# Altium project ANALOG_CAN_BOARD_2018.PrjPCB
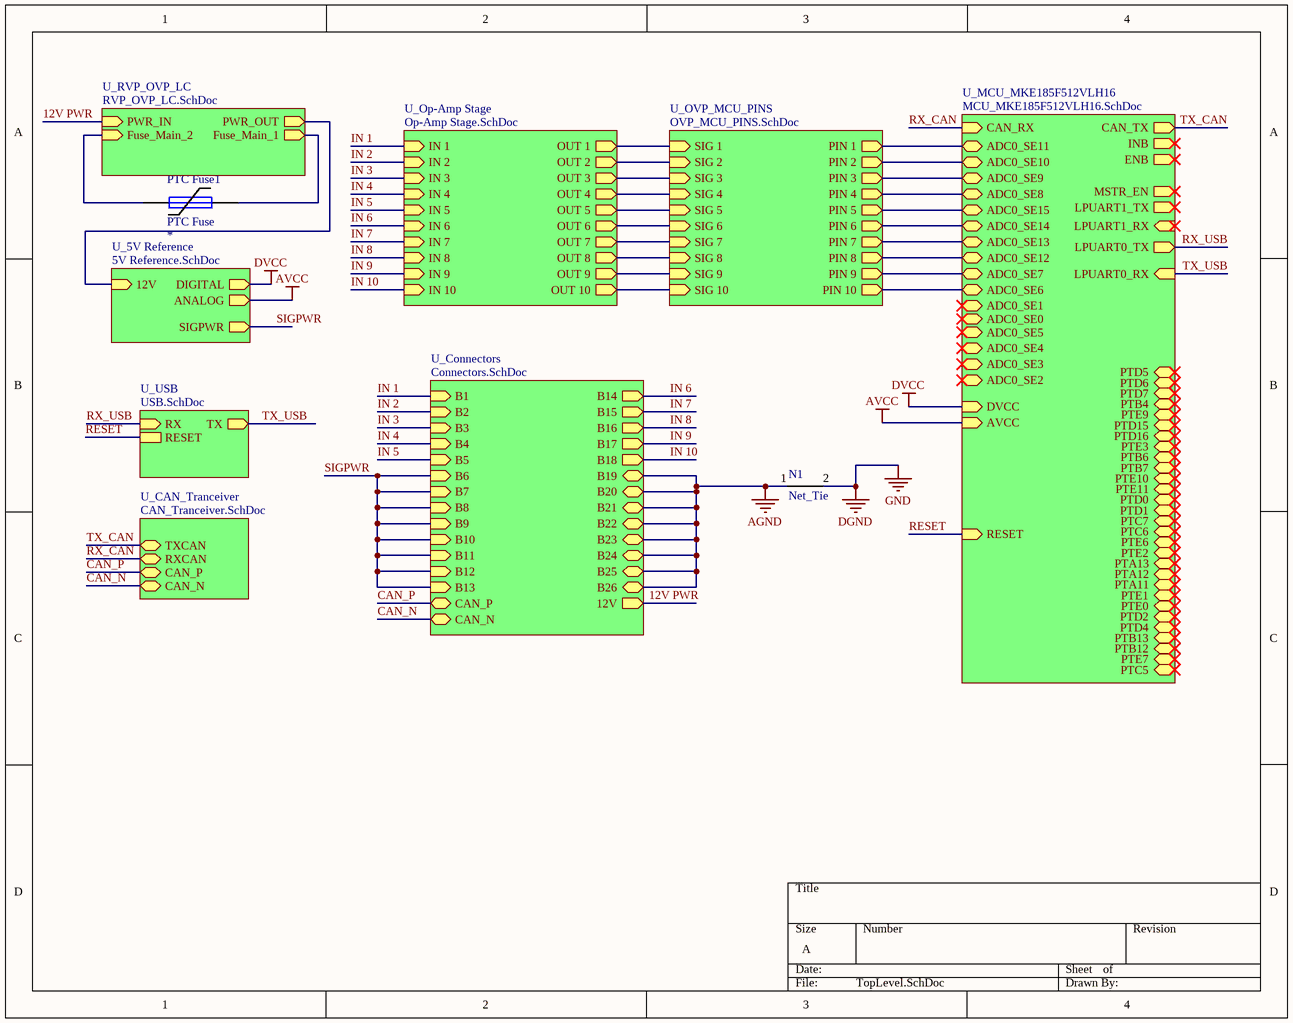
[diagram p0: TopLevel.SchDoc]
8 sheets, 169 parts. Net scope: hierarchical (ports join the sheet entries above them; power ports are global).
Board file: ANALOG_CAN2.PcbDoc
Sheets:
  TopLevel.SchDoc
    U_Connectors = Connectors.SchDoc
    U_5V Reference = 5V Reference.SchDoc
    U_OVP_MCU_PINS = OVP_MCU_PINS.SchDoc
    U_Op-Amp Stage = Op-Amp Stage.SchDoc
      U_Sallen-Key Filter = Sallen-Key Filter.SchDoc
      U_Sallen-Key Filter = Sallen-Key Filter.SchDoc
      U_Sallen-Key Filter = Sallen-Key Filter.SchDoc
      U_Sallen-Key Filter = Sallen-Key Filter.SchDoc
      U_Sallen-Key Filter = Sallen-Key Filter.SchDoc
      U_LBF Op-Amp Gain = LBF Op-Amp Gain.SchDoc
      U_LBF Op-Amp Gain = LBF Op-Amp Gain.SchDoc
      U_LBF Op-Amp Gain = LBF Op-Amp Gain.SchDoc
      U_LBF Op-Amp Gain = LBF Op-Amp Gain.SchDoc
      U_LBF Op-Amp Gain = LBF Op-Amp Gain.SchDoc
      U_MAX680_10V_Converter = MAX680_10V_Converter.SchDoc

## Sheet TopLevel.SchDoc
size A

### Parts
N1  Net_Tie  [Net_Tie]  (net tie, no BOM)
PTC_Fuse1  PTC Fuse  [PTC Fuse 2920/07351]

### Sub-sheets
U_5V Reference = 5V Reference.SchDoc: 12V (in), DIGITAL (out), ANALOG (out), SIGPWR (out)
U_CAN_Tranceiver = CAN_Tranceiver.SchDoc (file not in this document): TXCAN (bidir), RXCAN (bidir), CAN_P (bidir), CAN_N (bidir)
U_Connectors = Connectors.SchDoc: B1 (in), B2 (in), B3 (in), B4 (in), B5 (in), B6 (in), B7 (in), B8 (in), B9 (in), B10 (in), B11 (in), B12 (in), B13 (in), B14 (out), B15 (out), B16 (out), B17 (out), B18 (out), B19 (bidir), B20 (bidir), B21 (bidir), B22 (bidir), B23 (bidir), B24 (bidir), B25 (bidir), B26 (bidir), 12V (out), CAN_N (bidir), CAN_P (bidir)
U_MCU_MKE185F512VLH16 = MCU_MKE185F512VLH16.SchDoc (file not in this document): CAN_TX (out), CAN_RX (in), INB (out), ENB (out), ADC0_SE11 (bidir), ADC0_SE10 (bidir), ADC0_SE9 (bidir), ADC0_SE8 (bidir), ADC0_SE15 (bidir), ADC0_SE14 (bidir), ADC0_SE13 (bidir), ADC0_SE12 (bidir), ADC0_SE7 (bidir), ADC0_SE6 (bidir), ADC0_SE1 (bidir), ADC0_SE0 (bidir), LPUART0_TX (out), LPUART0_RX (in), MSTR_EN (out), ADC0_SE5 (bidir), ADC0_SE4 (bidir), LPUART1_TX (out), LPUART1_RX (in), ADC0_SE3 (bidir), ADC0_SE2 (bidir), DVCC (in), AVCC (in), PTD5 (bidir), PTD6 (bidir), PTD7 (bidir), PTB4 (bidir), PTE9 (bidir), PTD15 (bidir), PTD16 (bidir), PTE3 (bidir), PTB6 (bidir), PTB7 (bidir), PTE10 (bidir), PTE11 (bidir), PTD0 (bidir), PTD1 (bidir), PTC7 (bidir), PTC6 (bidir), PTE6 (bidir), PTE2 (bidir), PTA13 (bidir), PTA12 (bidir), PTA11 (bidir), PTE1 (bidir), PTE0 (bidir), RESET (in), PTD2 (bidir), PTD4 (bidir), PTB13 (bidir), PTB12 (bidir), PTE7 (bidir), PTC5 (bidir)
U_Op-Amp Stage = Op-Amp Stage.SchDoc: OUT 1 (out), OUT 2 (out), OUT 3 (out), OUT 4 (out), OUT 5 (out), OUT 6 (out), OUT 7 (out), OUT 8 (out), OUT 9 (out), OUT 10 (out), IN 1 (in), IN 2 (in), IN 3 (in), IN 4 (in), IN 5 (in), IN 6 (in), IN 7 (in), IN 8 (in), IN 9 (in), IN 10 (in)
U_OVP_MCU_PINS = OVP_MCU_PINS.SchDoc: SIG 1 (in), SIG 2 (in), PIN 1 (out), PIN 2 (out), SIG 3 (in), SIG 4 (in), PIN 3 (out), PIN 4 (out), SIG 5 (in), SIG 6 (in), PIN 5 (out), PIN 6 (out), SIG 7 (in), SIG 8 (in), PIN 7 (out), PIN 8 (out), SIG 9 (in), SIG 10 (in), PIN 9 (out), PIN 10 (out)
U_RVP_OVP_LC = RVP_OVP_LC.SchDoc (file not in this document): PWR_IN (in), PWR_OUT (out), Fuse_Main_2 (in), Fuse_Main_1 (out)
U_USB = USB.SchDoc (file not in this document): TX (out), RX (in), RESET

### Nets
AGND: N1.1 ; sheet U_Connectors/B19, sheet U_Connectors/B20, sheet U_Connectors/B21, sheet U_Connectors/B22, sheet U_Connectors/B23, sheet U_Connectors/B24, sheet U_Connectors/B25, sheet U_Connectors/B26
AVCC: sheet U_5V Reference/ANALOG, sheet U_MCU_MKE185F512VLH16/AVCC
DGND: N1.2  [also labelled GND]
DVCC: sheet U_5V Reference/DIGITAL, sheet U_MCU_MKE185F512VLH16/DVCC
12V: sheet U_RVP_OVP_LC/PWR_OUT, sheet U_5V Reference/12V
12V PWR: sheet U_RVP_OVP_LC/PWR_IN, sheet U_Connectors/12V
CAN_N: sheet U_CAN_Tranceiver/CAN_N, sheet U_Connectors/CAN_N
CAN_P: sheet U_CAN_Tranceiver/CAN_P, sheet U_Connectors/CAN_P
IN 1: sheet U_Connectors/B1, sheet U_Op-Amp Stage/IN 1
IN 2: sheet U_Connectors/B2, sheet U_Op-Amp Stage/IN 2
IN 3: sheet U_Connectors/B3, sheet U_Op-Amp Stage/IN 3
IN 4: sheet U_Connectors/B4, sheet U_Op-Amp Stage/IN 4
IN 5: sheet U_Connectors/B5, sheet U_Op-Amp Stage/IN 5
IN 6: sheet U_Connectors/B14, sheet U_Op-Amp Stage/IN 6
IN 7: sheet U_Connectors/B15, sheet U_Op-Amp Stage/IN 7
IN 8: sheet U_Connectors/B16, sheet U_Op-Amp Stage/IN 8
IN 9: sheet U_Connectors/B17, sheet U_Op-Amp Stage/IN 9
IN 10: sheet U_Connectors/B18, sheet U_Op-Amp Stage/IN 10
RESET: sheet U_USB/RESET, sheet U_MCU_MKE185F512VLH16/RESET
RX_CAN: sheet U_CAN_Tranceiver/RXCAN, sheet U_MCU_MKE185F512VLH16/CAN_RX
RX_USB: sheet U_USB/RX, sheet U_MCU_MKE185F512VLH16/LPUART0_TX
SIGPWR: sheet U_Connectors/B6, sheet U_Connectors/B7, sheet U_Connectors/B8, sheet U_Connectors/B9, sheet U_Connectors/B10, sheet U_Connectors/B11, sheet U_Connectors/B12, sheet U_Connectors/B13, sheet U_5V Reference/SIGPWR
TX_CAN: sheet U_CAN_Tranceiver/TXCAN, sheet U_MCU_MKE185F512VLH16/CAN_TX
TX_USB: sheet U_USB/TX, sheet U_MCU_MKE185F512VLH16/LPUART0_RX
Net*3_U_Op-Amp_Stage_U_LBF_Op-Amp_Gain#1_5: sheet U_OVP_MCU_PINS/SIG 2, sheet U_Op-Amp Stage/OUT 2
Net*3_U_Op-Amp_Stage_U_LBF_Op-Amp_Gain#1_7: sheet U_OVP_MCU_PINS/SIG 1, sheet U_Op-Amp Stage/OUT 1
Net*3_U_Op-Amp_Stage_U_LBF_Op-Amp_Gain#2_5: sheet U_OVP_MCU_PINS/SIG 4, sheet U_Op-Amp Stage/OUT 4
Net*3_U_Op-Amp_Stage_U_LBF_Op-Amp_Gain#2_7: sheet U_OVP_MCU_PINS/SIG 3, sheet U_Op-Amp Stage/OUT 3
Net*3_U_Op-Amp_Stage_U_LBF_Op-Amp_Gain#3_5: sheet U_OVP_MCU_PINS/SIG 6, sheet U_Op-Amp Stage/OUT 6
Net*3_U_Op-Amp_Stage_U_LBF_Op-Amp_Gain#3_7: sheet U_OVP_MCU_PINS/SIG 5, sheet U_Op-Amp Stage/OUT 5
Net*3_U_Op-Amp_Stage_U_LBF_Op-Amp_Gain#4_5: sheet U_OVP_MCU_PINS/SIG 8, sheet U_Op-Amp Stage/OUT 8
Net*3_U_Op-Amp_Stage_U_LBF_Op-Amp_Gain#4_7: sheet U_OVP_MCU_PINS/SIG 7, sheet U_Op-Amp Stage/OUT 7
Net*3_U_Op-Amp_Stage_U_LBF_Op-Amp_Gain#5_5: sheet U_OVP_MCU_PINS/SIG 10, sheet U_Op-Amp Stage/OUT 10
Net*3_U_Op-Amp_Stage_U_LBF_Op-Amp_Gain#5_7: sheet U_OVP_MCU_PINS/SIG 9, sheet U_Op-Amp Stage/OUT 9
NetA1_1: sheet U_OVP_MCU_PINS/PIN 1, sheet U_MCU_MKE185F512VLH16/ADC0_SE11
NetA1_2: sheet U_OVP_MCU_PINS/PIN 2, sheet U_MCU_MKE185F512VLH16/ADC0_SE10
NetA2_1: sheet U_OVP_MCU_PINS/PIN 3, sheet U_MCU_MKE185F512VLH16/ADC0_SE9
NetA2_2: sheet U_OVP_MCU_PINS/PIN 4, sheet U_MCU_MKE185F512VLH16/ADC0_SE8
NetA3_1: sheet U_OVP_MCU_PINS/PIN 5, sheet U_MCU_MKE185F512VLH16/ADC0_SE15
NetA3_2: sheet U_OVP_MCU_PINS/PIN 6, sheet U_MCU_MKE185F512VLH16/ADC0_SE14
NetA4_1: sheet U_OVP_MCU_PINS/PIN 7, sheet U_MCU_MKE185F512VLH16/ADC0_SE13
NetA4_2: sheet U_OVP_MCU_PINS/PIN 8, sheet U_MCU_MKE185F512VLH16/ADC0_SE12
NetA5_1: sheet U_OVP_MCU_PINS/PIN 9, sheet U_MCU_MKE185F512VLH16/ADC0_SE7
NetA5_2: sheet U_OVP_MCU_PINS/PIN 10, sheet U_MCU_MKE185F512VLH16/ADC0_SE6
NetPTC_Fuse1_1: PTC_Fuse1.1 ; sheet U_RVP_OVP_LC/Fuse_Main_2
NetPTC_Fuse1_2: PTC_Fuse1.2 ; sheet U_RVP_OVP_LC/Fuse_Main_1

### Library data of the parts
N1 = 1: Manufacturer_id: 1; idFuse: 3; Name: Net Tie; Drawer_id: 1; idShunt: 1
PTC_Fuse1 = 4: Fuse; Manufacturer_id: 1; MfrPartNo: 2920L200; idFuse: 4; Name: PTC Poly Fuse Resettable; Value: 2A hold, 4A trip, 40A max; I_hold: 2A; I_trip: 4A; I_max: 40A; Created_By: Eunice Bernardo; Published: 8-Jun-2000; LatestRevisionDate: 17-Jul-2002; LatestRevisionNote: Re-released for DXP Platform.; PackageReference: PIN-W2/E2.8; Publisher: Altium Limited; PackageDescription: Thru-Hole; 2 Leads; I-hold: *; Drawer_id: 1; Link: https://www.digikey.com/product-detail/en/littelfuse-inc/2920L200-24DR/F2872TR-ND/1211346; Created_Date: 10/27/2018

## Sheet Connectors.SchDoc
size A
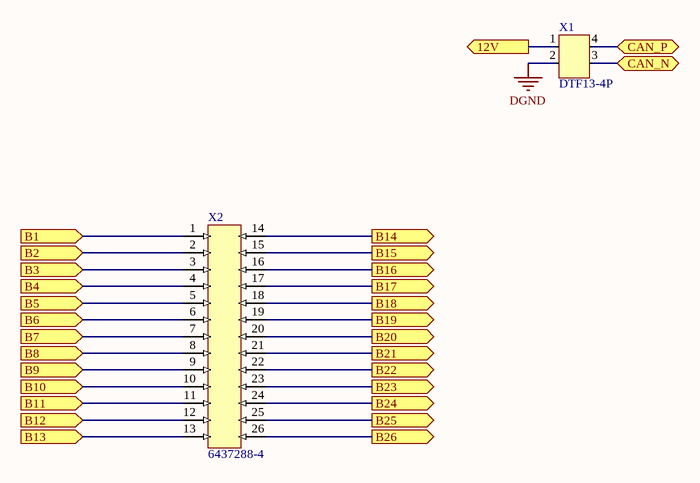
[diagram p1: Connectors.SchDoc]

### Parts
X1  DTF13-4P  [DTF13-4P]
X2  6437288-4  [SUPERSEAL 26POS 90Deg]

### Ports
12V (out), B1 (in), B2 (in), B3 (in), B4 (in), B5 (in), B6 (in), B7 (in), B8 (in), B9 (in), B10 (in), B11 (in), B12 (in), B13 (in), B14 (out), B15 (out), B16 (out), B17 (out), B18 (out), B19 (out), B20 (out), B21 (out), B22 (out), B23 (out), B24 (out), B25 (out), B26 (out), CAN_N (bidir), CAN_P (bidir)

### Nets
AGND: X2.19 X2.20 X2.21 X2.22 X2.23 X2.24 X2.25 X2.26 ; port B19, port B20, port B21, port B22, port B23, port B24, port B25, port B26
DGND: X1.2
12V PWR: X1.1 ; port 12V
CAN_N: X1.3 ; port CAN_N
CAN_P: X1.4 ; port CAN_P
IN 1: X2.1 ; port B1
IN 2: X2.2 ; port B2
IN 3: X2.3 ; port B3
IN 4: X2.4 ; port B4
IN 5: X2.5 ; port B5
IN 6: X2.14 ; port B14
IN 7: X2.15 ; port B15
IN 8: X2.16 ; port B16
IN 9: X2.17 ; port B17
IN 10: X2.18 ; port B18
SIGPWR: X2.6 X2.7 X2.8 X2.9 X2.10 X2.11 X2.12 X2.13 ; port B6, port B7, port B8, port B9, port B10, port B11, port B12, port B13

### Library data of the parts
X1 = 15: 2 row 4 pin Board; Manufacturer_id: 1; idConn: 15; Value: CONN; Num_Contacts: 4; Created_By: Angel; MfrPartNo: DTF13-4P; Drawer_id: 1; Name: DTF13-4P; Link: https://www.te.com/usa-en/product-DTF13-4P.html; ComponentLink1Description: Datasheet; Supplier1: TE
X2 = 21: 4 row connector; Manufacturer_id: 1; idConn: 21; Name: AMP Superseal 90Deg; Value: CONN; Num_Contacts: 26; Num_Rows: 4; Pitch: 3mm; Created_By: Angel; MfrPartNo: 6437288-4; Drawer_id: 1; Link: https://www.te.com/usa-en/product-6437288-4.html#guest-click; ComponentLink1Description: Datasheet; Supplier1: TE

## Sheet 5V Reference.SchDoc
size A
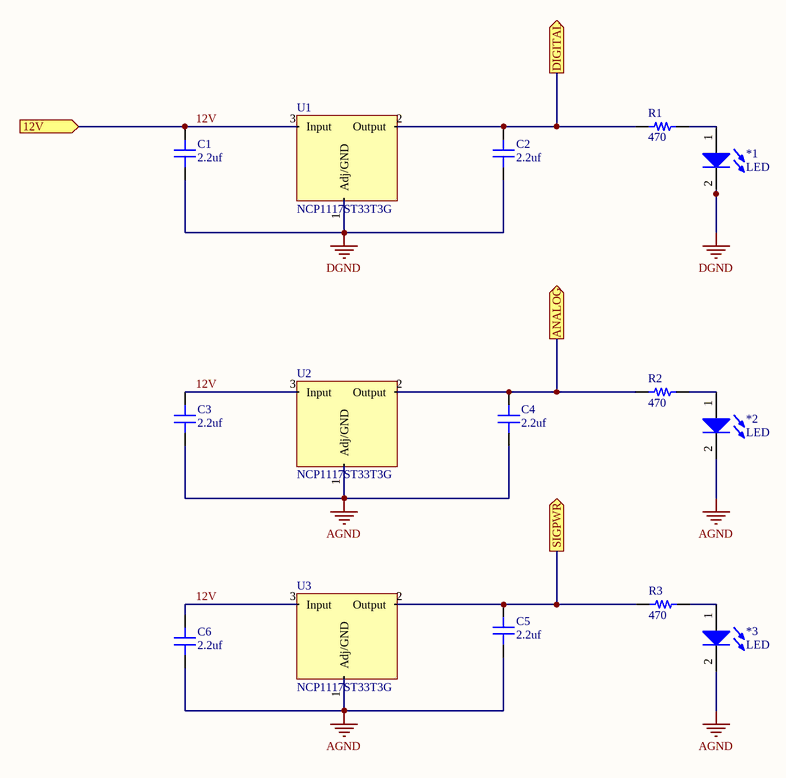
[diagram p2: 5V Reference.SchDoc]

### Parts
(Parts that share a designator on the sheet are numbered #1, #2 ... from top to bottom, then left to right.)
*1  LED  [0805_LED]
*2  LED  [0805_LED]
*3  LED  [0805_LED]
C1  value 2.2uf  [CAP 0805/2012]  (hidden comment: Capacitor MLCC 2.2uf 25V CAP 0805/2012)
C2  value 2.2uf  [CAP 0805/2012]  (hidden comment: Capacitor MLCC 2.2uf 25V CAP 0805/2012)
C3#1  value 2.2uf  [CAP 0805/2012]  (hidden comment: Capacitor MLCC 2.2uf 25V CAP 0805/2012)
C4#1  value 2.2uf  [CAP 0805/2012]  (hidden comment: Capacitor MLCC 2.2uf 25V CAP 0805/2012)
C5#1  value 2.2uf  [CAP 0805/2012]  (hidden comment: Capacitor MLCC 2.2uf 25V CAP 0805/2012)
C6#1  value 2.2uf  [CAP 0805/2012]  (hidden comment: Capacitor MLCC 2.2uf 25V CAP 0805/2012)
R1#1  value 470  [RES 0805/2012]  (hidden comment: Resistor 470 0805 1/10W 1%)
R2#1  value 470  [RES 0805/2012]  (hidden comment: Resistor 470 0805 1/10W 1%)
R3#1  value 470  [RES 0805/2012]  (hidden comment: Resistor 470 0805 1/10W 1%)
U1  NCP1117ST33T3G  [SOT-223-3]
U2#1  NCP1117ST33T3G  [SOT-223-3]
U3#1  NCP1117ST33T3G  [SOT-223-3]

### Ports
12V (in), ANALOG (out), DIGITAL (out), SIGPWR (out)

### Nets
AGND: *2.2(K) *3.2(K) C3#1.1 C4#1.1 C5#1.1 C6#1.1 U2#1.1(Adj/GND) U3#1.1(Adj/GND)
AVCC: C4#1.2 R2#1.1 U2#1.2(Output) ; port ANALOG
DGND: *1.2(K) C1.1 C2.1 U1.1(Adj/GND)
DVCC: C2.2 R1#1.1 U1.2(Output) ; port DIGITAL
12V: C1.2 C3#1.2 C6#1.2 U1.3(Input) U2#1.3(Input) U3#1.3(Input) ; port 12V
SIGPWR: C5#1.2 R3#1.1 U3#1.2(Output) ; port SIGPWR
Net*1_1: *1.1(A) R1#1.2
Net*2_1: *2.1(A) R2#1.2
Net*3_1: *3.1(A) R3#1.2

### Library data of the parts
*1-*3 = 2: Manufacturer_id: 1; idLED: 2; Name: CMD17_0805_GREEN; Value: Green; Brightness: 7mcd; Id: 20mA; Vf: 2.1V; Drawer_id: 1; Package: 0805; Link: https://www.digikey.com/product-detail/en/visual-communications-company-vcc/CMD17-21VGD-TR8/L62505CT-ND/254936
C1 C2 C3#1 C4#1 C5#1 C6#1 = 711: Manufacturer_id: 1; idCapacitor: 711; Name: Cap_2.2uf_25V_CAP 0805/2012; Dielectric: Ceramic; Created_By: Nick Mah; Drawer_id: 1; Voltage_Rating: 25V; Package: CAP 0805/2012; Created_Date: 10/20/2018
R1#1 R2#1 R3#1 = 497: Manufacturer_id: 1; idResistor: 497; Name: Res_470_0805_1/10W_1%; Created_By: Nick Mah; Supplier 1: Digi-Key; Drawer_id: 1; Tolerance: 1%; Power: 1/10W; Package: 0805; ComponentLink1Description: Datasheet; Created_Date: 2018-10-20
U1 U2#1 U3#1 = 15: 1.0 A Low Dropout Positive and Adjustable Voltage Regulator; Manufacturer_id: 1; idPMIC_Lin: 15; Name: 3.3V 1.0A LDO; Value: 3.3V 1.0A; Vin(Max): 20V; Vout(Max): 3.3V; Current_Rating: 1A; Dropout_Voltage: 1.2V @ 800mA; Drawer_id: 1; Num_Outputs: 1; Package: SOT-223-3; MfrPartNo: NCP1117ST33T3G; Link: https://www.digikey.com/product-detail/en/on-semiconductor/NCP1117ST33T3G/NCP1117ST33T3GOSCT-ND/660708?utm_adgroup=Integrated%20Circuits&slid=&gclid=CjwKCAjwpKveBRAwEiwAo4Pqm-q33kFM8zFNc6HZ2F-pR13_ETd6YlqjCAqcJjAXoyQWdArbQQWp4hoCk3EQAvD_BwE

## Sheet OVP_MCU_PINS.SchDoc
size A
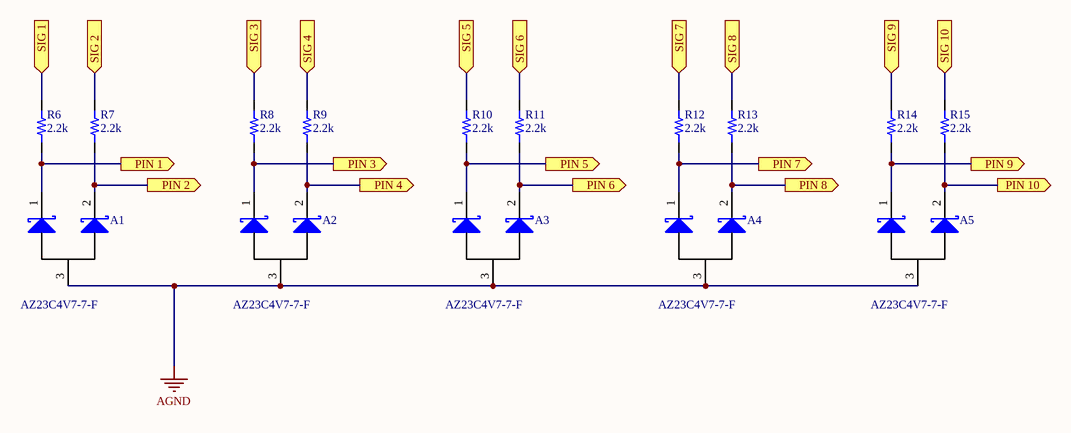
[diagram p3: OVP_MCU_PINS.SchDoc]

### Parts
(Parts that share a designator on the sheet are numbered #1, #2 ... from top to bottom, then left to right.)
A1  AZ23C4V7-7-F  [SOT23-3]
A2  AZ23C4V7-7-F  [SOT23-3]
A3  AZ23C4V7-7-F  [SOT23-3]
A4  AZ23C4V7-7-F  [SOT23-3]
A5  AZ23C4V7-7-F  [SOT23-3]
R6#1  value 2.2k  [RES 0805/2012]  (hidden comment: Resistor 2.2k 0805 1/4W 5%)
R7#1  value 2.2k  [RES 0805/2012]  (hidden comment: Resistor 2.2k 0805 1/4W 5%)
R8#1  value 2.2k  [RES 0805/2012]  (hidden comment: Resistor 2.2k 0805 1/4W 5%)
R9#1  value 2.2k  [RES 0805/2012]  (hidden comment: Resistor 2.2k 0805 1/4W 5%)
R10#1  value 2.2k  [RES 0805/2012]  (hidden comment: Resistor 2.2k 0805 1/4W 5%)
R11#1  value 2.2k  [RES 0805/2012]  (hidden comment: Resistor 2.2k 0805 1/4W 5%)
R12#1  value 2.2k  [RES 0805/2012]  (hidden comment: Resistor 2.2k 0805 1/4W 5%)
R13#1  value 2.2k  [RES 0805/2012]  (hidden comment: Resistor 2.2k 0805 1/4W 5%)
R14#1  value 2.2k  [RES 0805/2012]  (hidden comment: Resistor 2.2k 0805 1/4W 5%)
R15#1  value 2.2k  [RES 0805/2012]  (hidden comment: Resistor 2.2k 0805 1/4W 5%)

### Ports
PIN 1 (out), PIN 2 (out), PIN 3 (out), PIN 4 (out), PIN 5 (out), PIN 6 (out), PIN 7 (out), PIN 8 (out), PIN 9 (out), PIN 10 (out), SIG 1 (in), SIG 2 (in), SIG 3 (in), SIG 4 (in), SIG 5 (in), SIG 6 (in), SIG 7 (in), SIG 8 (in), SIG 9 (in), SIG 10 (in)

### Nets
AGND: A1.3 A2.3 A3.3 A4.3 A5.3
Net*3_U_Op-Amp_Stage_U_LBF_Op-Amp_Gain#1_5: R7#1.2 ; port SIG 2
Net*3_U_Op-Amp_Stage_U_LBF_Op-Amp_Gain#1_7: R6#1.2 ; port SIG 1
Net*3_U_Op-Amp_Stage_U_LBF_Op-Amp_Gain#2_5: R9#1.2 ; port SIG 4
Net*3_U_Op-Amp_Stage_U_LBF_Op-Amp_Gain#2_7: R8#1.2 ; port SIG 3
Net*3_U_Op-Amp_Stage_U_LBF_Op-Amp_Gain#3_5: R11#1.2 ; port SIG 6
Net*3_U_Op-Amp_Stage_U_LBF_Op-Amp_Gain#3_7: R10#1.2 ; port SIG 5
Net*3_U_Op-Amp_Stage_U_LBF_Op-Amp_Gain#4_5: R13#1.2 ; port SIG 8
Net*3_U_Op-Amp_Stage_U_LBF_Op-Amp_Gain#4_7: R12#1.2 ; port SIG 7
Net*3_U_Op-Amp_Stage_U_LBF_Op-Amp_Gain#5_5: R15#1.2 ; port SIG 10
Net*3_U_Op-Amp_Stage_U_LBF_Op-Amp_Gain#5_7: R14#1.2 ; port SIG 9
NetA1_1: A1.1 R6#1.1 ; port PIN 1
NetA1_2: A1.2 R7#1.1 ; port PIN 2
NetA2_1: A2.1 R8#1.1 ; port PIN 3
NetA2_2: A2.2 R9#1.1 ; port PIN 4
NetA3_1: A3.1 R10#1.1 ; port PIN 5
NetA3_2: A3.2 R11#1.1 ; port PIN 6
NetA4_1: A4.1 R12#1.1 ; port PIN 7
NetA4_2: A4.2 R13#1.1 ; port PIN 8
NetA5_1: A5.1 R14#1.1 ; port PIN 9
NetA5_2: A5.2 R15#1.1 ; port PIN 10

### Library data of the parts
A1-A5 = 14: DIODE ZENER ARRAY 4.7V SOT23-3; Manufacturer_id: 1; idDiode: 14; Num_Circuits: 2; Power: 300mW; Created_By: Angel Delgado; Drawer_id: 1; Name: AZ23C4V7-7-F; Value: 4.7V; Type: Zener Array; Package: SOT23-3; MfrPartNo: AZ23C4V7-7-F; Link: https://www.digikey.com/product-detail/en/diodes-incorporated/AZ23C4V7-7-F/AZ23C4V7-FDICT-ND/815309; Supplier1: Digi-Key
R6#1 R7#1 R8#1 R9#1 R10#1 R11#1 R12#1 R13#1 R14#1 R15#1 = 1809: Manufacturer_id: 1; idResistor: 1809; Name: Res_2.2k_0805_1/4W_5%; Created_By: Nick Mah; Supplier 1: Digi-Key; Drawer_id: 1; Tolerance: 5%; Power: 1/4W; Package: 0805; ComponentLink1Description: Datasheet; Created_Date: 2018-10-20

## Sheet Op-Amp Stage.SchDoc
size A
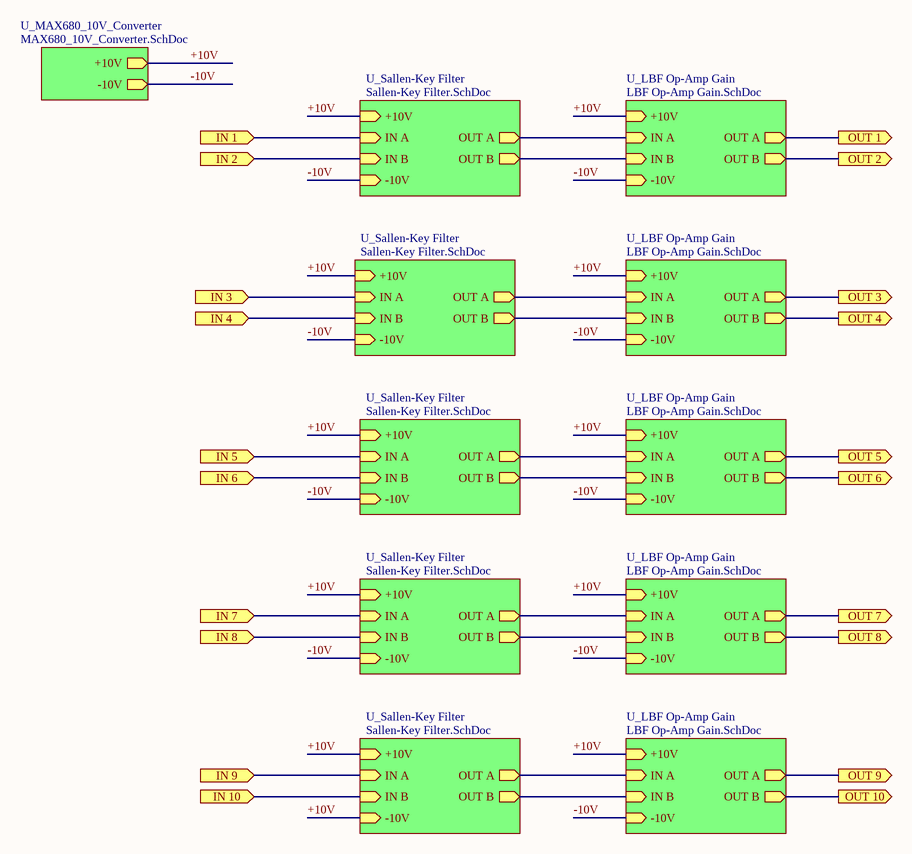
[diagram p4: Op-Amp Stage.SchDoc]

### Sub-sheets
U_LBF Op-Amp Gain = LBF Op-Amp Gain.SchDoc: IN A (in), IN B (in), OUT B (out), OUT A (out), +10V (in), -10V (in)
U_LBF Op-Amp Gain = LBF Op-Amp Gain.SchDoc: IN A (in), IN B (in), OUT B (out), OUT A (out), +10V (in), -10V (in)
U_LBF Op-Amp Gain = LBF Op-Amp Gain.SchDoc: IN A (in), IN B (in), OUT B (out), OUT A (out), +10V (in), -10V (in)
U_LBF Op-Amp Gain = LBF Op-Amp Gain.SchDoc: IN A (in), IN B (in), OUT B (out), OUT A (out), +10V (in), -10V (in)
U_LBF Op-Amp Gain = LBF Op-Amp Gain.SchDoc: IN A (in), IN B (in), OUT B (out), OUT A (out), +10V (in), -10V (in)
U_MAX680_10V_Converter = MAX680_10V_Converter.SchDoc: -10V (out), +10V (out)
U_Sallen-Key Filter = Sallen-Key Filter.SchDoc: IN A (in), OUT A (out), OUT B (out), IN B (in), +10V (in), -10V (in)
U_Sallen-Key Filter = Sallen-Key Filter.SchDoc: IN A (in), OUT A (out), OUT B (out), IN B (in), +10V (in), -10V (in)
U_Sallen-Key Filter = Sallen-Key Filter.SchDoc: IN A (in), OUT A (out), OUT B (out), IN B (in), +10V (in), -10V (in)
U_Sallen-Key Filter = Sallen-Key Filter.SchDoc: IN A (in), OUT A (out), OUT B (out), IN B (in), +10V (in), -10V (in)
U_Sallen-Key Filter = Sallen-Key Filter.SchDoc: IN A (in), OUT A (out), OUT B (out), IN B (in), +10V (in), -10V (in)

### Ports
IN 1 (in), IN 2 (in), IN 3 (in), IN 4 (in), IN 5 (in), IN 6 (in), IN 7 (in), IN 8 (in), IN 9 (in), IN 10 (in), OUT 1 (out), OUT 2 (out), OUT 3 (out), OUT 4 (out), OUT 5 (out), OUT 6 (out), OUT 7 (out), OUT 8 (out), OUT 9 (out), OUT 10 (out)

### Nets
+10V: sheet U_Sallen-Key Filter/+10V, sheet U_Sallen-Key Filter/+10V, sheet U_Sallen-Key Filter/+10V, sheet U_Sallen-Key Filter/+10V, sheet U_Sallen-Key Filter/+10V, sheet U_Sallen-Key Filter/-10V, sheet U_LBF Op-Amp Gain/+10V, sheet U_LBF Op-Amp Gain/+10V, sheet U_LBF Op-Amp Gain/+10V, sheet U_LBF Op-Amp Gain/+10V, sheet U_LBF Op-Amp Gain/+10V, sheet U_MAX680_10V_Converter/+10V
-10V: sheet U_Sallen-Key Filter/-10V, sheet U_Sallen-Key Filter/-10V, sheet U_Sallen-Key Filter/-10V, sheet U_Sallen-Key Filter/-10V, sheet U_LBF Op-Amp Gain/-10V, sheet U_LBF Op-Amp Gain/-10V, sheet U_LBF Op-Amp Gain/-10V, sheet U_LBF Op-Amp Gain/-10V, sheet U_LBF Op-Amp Gain/-10V, sheet U_MAX680_10V_Converter/-10V
IN 1: port IN 1, sheet U_Sallen-Key Filter/IN A
IN 2: port IN 2, sheet U_Sallen-Key Filter/IN B
IN 3: port IN 3, sheet U_Sallen-Key Filter/IN A
IN 4: port IN 4, sheet U_Sallen-Key Filter/IN B
IN 5: port IN 5, sheet U_Sallen-Key Filter/IN A
IN 6: port IN 6, sheet U_Sallen-Key Filter/IN B
IN 7: port IN 7, sheet U_Sallen-Key Filter/IN A
IN 8: port IN 8, sheet U_Sallen-Key Filter/IN B
IN 9: port IN 9, sheet U_Sallen-Key Filter/IN A
IN 10: port IN 10, sheet U_Sallen-Key Filter/IN B
Net*3_U_Op-Amp_Stage_U_LBF_Op-Amp_Gain#1_5: port OUT 2, sheet U_LBF Op-Amp Gain/OUT B
Net*3_U_Op-Amp_Stage_U_LBF_Op-Amp_Gain#1_7: port OUT 1, sheet U_LBF Op-Amp Gain/OUT A
Net*3_U_Op-Amp_Stage_U_LBF_Op-Amp_Gain#2_5: port OUT 4, sheet U_LBF Op-Amp Gain/OUT B
Net*3_U_Op-Amp_Stage_U_LBF_Op-Amp_Gain#2_7: port OUT 3, sheet U_LBF Op-Amp Gain/OUT A
Net*3_U_Op-Amp_Stage_U_LBF_Op-Amp_Gain#3_5: port OUT 6, sheet U_LBF Op-Amp Gain/OUT B
Net*3_U_Op-Amp_Stage_U_LBF_Op-Amp_Gain#3_7: port OUT 5, sheet U_LBF Op-Amp Gain/OUT A
Net*3_U_Op-Amp_Stage_U_LBF_Op-Amp_Gain#4_5: port OUT 8, sheet U_LBF Op-Amp Gain/OUT B
Net*3_U_Op-Amp_Stage_U_LBF_Op-Amp_Gain#4_7: port OUT 7, sheet U_LBF Op-Amp Gain/OUT A
Net*3_U_Op-Amp_Stage_U_LBF_Op-Amp_Gain#5_5: port OUT 10, sheet U_LBF Op-Amp Gain/OUT B
Net*3_U_Op-Amp_Stage_U_LBF_Op-Amp_Gain#5_7: port OUT 9, sheet U_LBF Op-Amp Gain/OUT A
NetC3#2_2: sheet U_Sallen-Key Filter/OUT B, sheet U_LBF Op-Amp Gain/IN B
NetC4#2_2: sheet U_Sallen-Key Filter/OUT A, sheet U_LBF Op-Amp Gain/IN A
NetC5#2_2: sheet U_Sallen-Key Filter/OUT B, sheet U_LBF Op-Amp Gain/IN B
NetC6#2_2: sheet U_Sallen-Key Filter/OUT A, sheet U_LBF Op-Amp Gain/IN A
NetC7#1_2: sheet U_Sallen-Key Filter/OUT B, sheet U_LBF Op-Amp Gain/IN B
NetC8#1_2: sheet U_Sallen-Key Filter/OUT A, sheet U_LBF Op-Amp Gain/IN A
NetC9#1_2: sheet U_Sallen-Key Filter/OUT B, sheet U_LBF Op-Amp Gain/IN B
NetC10#1_2: sheet U_Sallen-Key Filter/OUT A, sheet U_LBF Op-Amp Gain/IN A
NetC11_2: sheet U_Sallen-Key Filter/OUT B, sheet U_LBF Op-Amp Gain/IN B
NetC12_2: sheet U_Sallen-Key Filter/OUT A, sheet U_LBF Op-Amp Gain/IN A

## Sheet Sallen-Key Filter.SchDoc
size A
Used 5 times, as channels U_Op-Amp Stage/U_Sallen-Key Filter, U_Op-Amp Stage/U_Sallen-Key Filter, U_Op-Amp Stage/U_Sallen-Key Filter, U_Op-Amp Stage/U_Sallen-Key Filter, U_Op-Amp Stage/U_Sallen-Key Filter. Parts and nets are listed once, with the designators drawn on the sheet.
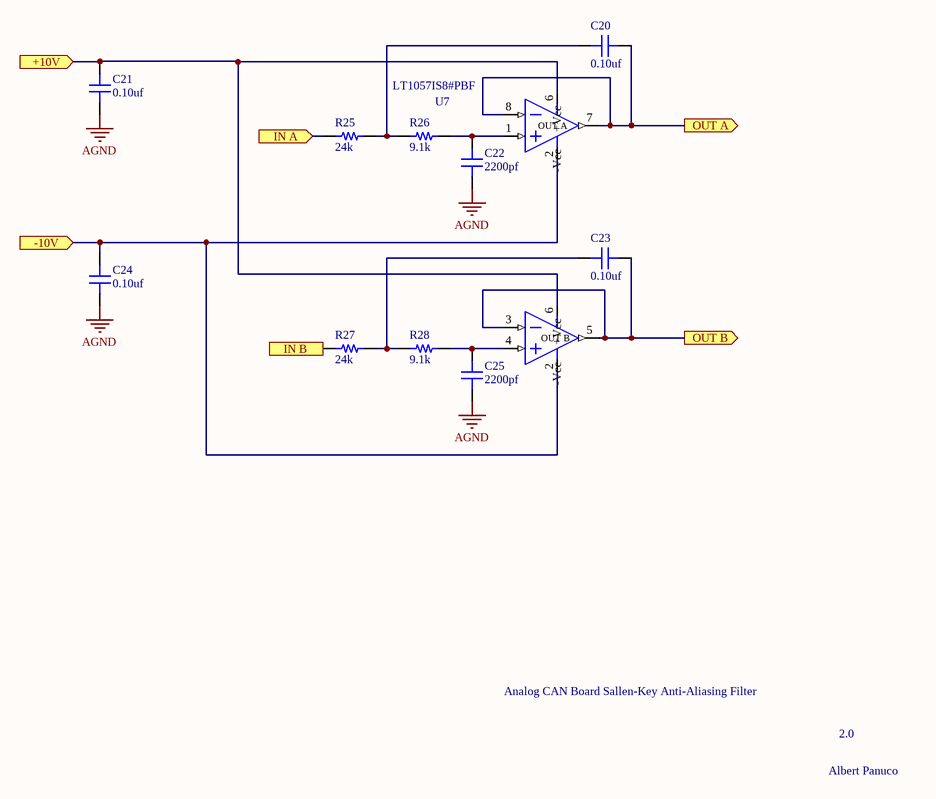
[diagram p5: Sallen-Key Filter.SchDoc]

### Parts
C20  value 0.10uf  [CAP 0805/2012]  (hidden comment: Capacitor MLCC 0.10uf 25V CAP 0805/2012)
C21  value 0.10uf  [CAP 0805/2012]  (hidden comment: Capacitor MLCC 0.10uf 25V CAP 0805/2012)
C22  value 2200pf  [CAP 0805/2012]  (hidden comment: Capacitor MLCC 2200pf 25V CAP 0805/2012)
C23  value 0.10uf  [CAP 0805/2012]  (hidden comment: Capacitor MLCC 0.10uf 25V CAP 0805/2012)
C24  value 0.10uf  [CAP 0805/2012]  (hidden comment: Capacitor MLCC 0.10uf 25V CAP 0805/2012)
C25  value 2200pf  [CAP 0805/2012]  (hidden comment: Capacitor MLCC 2200pf 25V CAP 0805/2012)
R25  value 24k  [RES 0805/2012]  (hidden comment: Resistor 24k 0805 1/10W 1%)
R26  value 9.1k  [RES 0805/2012]  (hidden comment: Resistor 9.1k 0805 1/10W 1%)
R27  value 24k  [RES 0805/2012]  (hidden comment: Resistor 24k 0805 1/10W 1%)
R28  value 9.1k  [RES 0805/2012]  (hidden comment: Resistor 9.1k 0805 1/10W 1%)
U7  LT1057IS8#PBF  [SOIC-8]

### Ports
+10V (in), -10V (in), IN A (in), IN B (in), OUT A (out), OUT B (out)

### Nets
AGND: C21.1 C22.1 C24.2 C25.1
+10V: C21.2 U7.6(+Vcc) ; port +10V
-10V: C24.1 U7.2(-Vcc) ; port -10V
IN A: R25.1 ; port IN A
IN B: R27.1 ; port IN B
OUT A: C20.2 U7.7(OUT_A) U7.8(-IN_A) ; port OUT A
OUT B: C23.2 U7.3(+IN_B) U7.5(OUT_B) ; port OUT B
NetC20_1: C20.1 R25.2 R26.1
NetC22_2: C22.2 R26.2 U7.1(+IN_A)
NetC23_1: C23.1 R27.2 R28.1
NetC25_2: C25.2 R28.2 U7.4(+IN_B)

### Channels
U_Op-Amp Stage/U_Sallen-Key Filter: designators C20=C8#1 C21=C29 C22=C43 C23=C7#1 C24=C35 C25=C42 R25=R6#2 R26=R16 R27=R5 R28=R15#2 U7=U4; ports +10V=+10V -10V=-10V IN A=IN 5 IN B=IN 6 OUT A=NetC8#1_2 OUT B=NetC7#1_2
U_Op-Amp Stage/U_Sallen-Key Filter: designators C20=C6#2 C21=C28 C22=C41 C23=C5#2 C24=C33 C25=C40 R25=R4 R26=R14#2 R27=R3#2 R28=R13#2 U7=U3#2; ports +10V=+10V -10V=-10V IN A=IN 7 IN B=IN 8 OUT A=NetC6#2_2 OUT B=NetC5#2_2
U_Op-Amp Stage/U_Sallen-Key Filter: designators C20=C10#1 C21=C30 C22=C45 C23=C9#1 C24=C36 C25=C44 R25=R8#2 R26=R18 R27=R7#2 R28=R17 U7=U5; ports +10V=+10V -10V=-10V IN A=IN 3 IN B=IN 4 OUT A=NetC10#1_2 OUT B=NetC9#1_2
U_Op-Amp Stage/U_Sallen-Key Filter: designators C20=C12 C21=C31 C22=C47 C23=C11 C24=C37 C25=C46 R25=R10#2 R26=R20 R27=R9#2 R28=R19 U7=U6; ports +10V=+10V -10V=-10V IN A=IN 1 IN B=IN 2 OUT A=NetC12_2 OUT B=NetC11_2
U_Op-Amp Stage/U_Sallen-Key Filter: designators C20=C4#2 C21=C27 C22=C39 C23=C3#2 C24=C34 C25=C38 R25=R2#2 R26=R12#2 R27=R1#2 R28=R11#2 U7=U2#2; ports +10V=+10V -10V=+10V IN A=IN 9 IN B=IN 10 OUT A=NetC4#2_2 OUT B=NetC3#2_2

### Notes on the sheet
- Analog CAN Board Sallen-Key Anti-Aliasing Filter
- 2.0
- Albert Panuco

### Library data of the parts
C20 C21 C23 C24 = 703: Manufacturer_id: 1; idCapacitor: 703; Name: Cap_0.10uf_25V_CAP 0805/2012; Dielectric: Ceramic; Created_By: Nick Mah; Drawer_id: 1; Voltage_Rating: 25V; Package: CAP 0805/2012; Created_Date: 10/20/2018
C22 C25 = 681: Manufacturer_id: 1; idCapacitor: 681; Name: Cap_2200pf_25V_CAP 0805/2012; Dielectric: Ceramic; Created_By: Nick Mah; Drawer_id: 1; Voltage_Rating: 25V; Package: CAP 0805/2012; Created_Date: 10/20/2018
R25 R27 = 538: Manufacturer_id: 1; idResistor: 538; Name: Res_24k_0805_1/10W_1%; Created_By: Nick Mah; Supplier 1: Digi-Key; Drawer_id: 1; Tolerance: 1%; Power: 1/10W; Package: 0805; ComponentLink1Description: Datasheet; Created_Date: 2018-10-20
R26 R28 = 528: Manufacturer_id: 1; idResistor: 528; Name: Res_9.1k_0805_1/10W_1%; Created_By: Nick Mah; Supplier 1: Digi-Key; Drawer_id: 1; Tolerance: 1%; Power: 1/10W; Package: 0805; ComponentLink1Description: Datasheet; Created_Date: 2018-10-20
U7 = 1: IC OPAMP JFET 5MHZ 8SO; idOp_Amp: 1; Num_Circuits: 2; Slew_Rate: 13 V/us; Supply_Voltage: 10~18; Created_By: Albert Panuco; Manufacturer_id: 1; Drawer_id: 1; Name: OPAMP JFET; Amplifier_Type: JFET; GBW: 5MHz; Package: 8-SO; MfrPartNo: LT1057IS8#PBF; Link: https://www.digikey.com/product-detail/en/linear-technology-analog-devices/LT1057IS8-PBF/LT1057IS8-PBF-ND/961410; Supplier1: Digikey; Supplier1PartNo: LT1057IS8#PBF-ND

## Sheet LBF Op-Amp Gain.SchDoc
size A
Used 5 times, as channels U_Op-Amp Stage/U_LBF Op-Amp Gain, U_Op-Amp Stage/U_LBF Op-Amp Gain, U_Op-Amp Stage/U_LBF Op-Amp Gain, U_Op-Amp Stage/U_LBF Op-Amp Gain, U_Op-Amp Stage/U_LBF Op-Amp Gain. Parts and nets are listed once, with the designators drawn on the sheet.
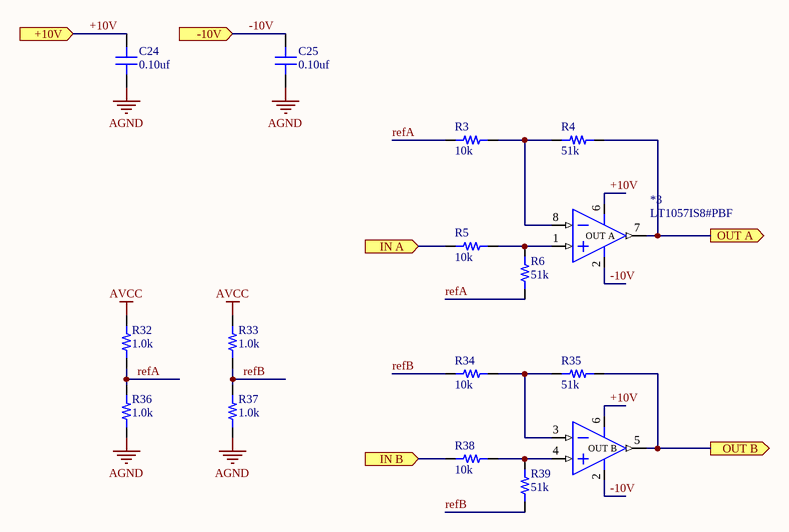
[diagram p6: LBF Op-Amp Gain.SchDoc]

### Parts
*3  LT1057IS8#PBF  [SOIC-8]
C24  value 0.10uf  [CAP 0805/2012]  (hidden comment: Capacitor MLCC 0.10uf 25V CAP 0805/2012)
C25  value 0.10uf  [CAP 0805/2012]  (hidden comment: Capacitor MLCC 0.10uf 25V CAP 0805/2012)
R3  value 10k  [RES 0805/2012]  (hidden comment: Resistor 10k 0805 1/10W 1%)
R4  value 51k  [RES 0805/2012]  (hidden comment: Resistor 51k 0805 1/10W 1%)
R5  value 10k  [RES 0805/2012]  (hidden comment: Resistor 10k 0805 1/10W 1%)
R6  value 51k  [RES 0805/2012]  (hidden comment: Resistor 51k 0805 1/10W 1%)
R32  value 1.0k  [RES 0805/2012]  (hidden comment: Resistor 1.0k 0805 1/10W 1%)
R33  value 1.0k  [RES 0805/2012]  (hidden comment: Resistor 1.0k 0805 1/10W 1%)
R34  value 10k  [RES 0805/2012]  (hidden comment: Resistor 10k 0805 1/10W 1%)
R35  value 51k  [RES 0805/2012]  (hidden comment: Resistor 51k 0805 1/10W 1%)
R36  value 1.0k  [RES 0805/2012]  (hidden comment: Resistor 1.0k 0805 1/10W 1%)
R37  value 1.0k  [RES 0805/2012]  (hidden comment: Resistor 1.0k 0805 1/10W 1%)
R38  value 10k  [RES 0805/2012]  (hidden comment: Resistor 10k 0805 1/10W 1%)
R39  value 51k  [RES 0805/2012]  (hidden comment: Resistor 51k 0805 1/10W 1%)

### Ports
+10V (in), -10V (in), IN A (in), IN B (in), OUT A (out), OUT B (out)

### Nets
AGND: C24.1 C25.1 R36.1 R37.1
AVCC: R32.2 R33.2
+10V: *3.6(+Vcc) C24.2 ; port +10V
-10V: *3.2(-Vcc) C25.2 ; port -10V
IN A: R5.1 ; port IN A
IN B: R38.1 ; port IN B
OUT A: *3.7(OUT_A) R4.2 ; port OUT A
OUT B: *3.5(OUT_B) R35.2 ; port OUT B
refA: R3.1 R6.2 R32.1 R36.2
refB: R33.1 R34.1 R37.2 R39.2
Net*3_1: *3.1(+IN_A) R5.2 R6.1
Net*3_3: *3.3(+IN_B) R34.2 R35.1
Net*3_4: *3.4(+IN_B) R38.2 R39.1
Net*3_8: *3.8(-IN_A) R3.2 R4.1

### Channels
U_Op-Amp Stage/U_LBF Op-Amp Gain: designators end in _U_Op-Amp_Stage_U_LBF_Op-Amp_Gain#1; ports +10V=+10V -10V=-10V IN A=NetC12_2 IN B=NetC11_2 OUT A=Net*3_U_Op-Amp_Stage_U_LBF_Op-Amp_Gain#1_7 OUT B=Net*3_U_Op-Amp_Stage_U_LBF_Op-Amp_Gain#1_5
U_Op-Amp Stage/U_LBF Op-Amp Gain: designators end in _U_Op-Amp_Stage_U_LBF_Op-Amp_Gain#2; ports +10V=+10V -10V=-10V IN A=NetC10#1_2 IN B=NetC9#1_2 OUT A=Net*3_U_Op-Amp_Stage_U_LBF_Op-Amp_Gain#2_7 OUT B=Net*3_U_Op-Amp_Stage_U_LBF_Op-Amp_Gain#2_5
U_Op-Amp Stage/U_LBF Op-Amp Gain: designators end in _U_Op-Amp_Stage_U_LBF_Op-Amp_Gain#3; ports +10V=+10V -10V=-10V IN A=NetC8#1_2 IN B=NetC7#1_2 OUT A=Net*3_U_Op-Amp_Stage_U_LBF_Op-Amp_Gain#3_7 OUT B=Net*3_U_Op-Amp_Stage_U_LBF_Op-Amp_Gain#3_5
U_Op-Amp Stage/U_LBF Op-Amp Gain: designators end in _U_Op-Amp_Stage_U_LBF_Op-Amp_Gain#4; ports +10V=+10V -10V=-10V IN A=NetC6#2_2 IN B=NetC5#2_2 OUT A=Net*3_U_Op-Amp_Stage_U_LBF_Op-Amp_Gain#4_7 OUT B=Net*3_U_Op-Amp_Stage_U_LBF_Op-Amp_Gain#4_5
U_Op-Amp Stage/U_LBF Op-Amp Gain: designators end in _U_Op-Amp_Stage_U_LBF_Op-Amp_Gain#5; ports +10V=+10V -10V=-10V IN A=NetC4#2_2 IN B=NetC3#2_2 OUT A=Net*3_U_Op-Amp_Stage_U_LBF_Op-Amp_Gain#5_7 OUT B=Net*3_U_Op-Amp_Stage_U_LBF_Op-Amp_Gain#5_5

### Library data of the parts
*3 = 1: as U7 on sheet Sallen-Key Filter; Manufacturer_id: 1; Drawer_id: 1; Name: OPAMP JFET; Amplifier_Type: JFET; GBW: 5MHz; Package: 8-SO; MfrPartNo: LT1057IS8#PBF; Link: https://www.digikey.com/product-detail/en/linear-technology-analog-devices/LT1057IS8-PBF/LT1057IS8-PBF-ND/961410; Supplier1: Digikey; Supplier1PartNo: LT1057IS8#PBF-ND
C24 C25 = 703: as C20 on sheet Sallen-Key Filter; Drawer_id: 1; Voltage_Rating: 25V; Package: CAP 0805/2012; Created_Date: 10/20/2018
R3 R5 R34 R38 = 529: Manufacturer_id: 1; idResistor: 529; Name: Res_10k_0805_1/10W_1%; Created_By: Nick Mah; Supplier 1: Digi-Key; Drawer_id: 1; Tolerance: 1%; Power: 1/10W; Package: 0805; ComponentLink1Description: Datasheet; Created_Date: 2018-10-20
R4 R6 R35 R39 = 546: Manufacturer_id: 1; idResistor: 546; Name: Res_51k_0805_1/10W_1%; Created_By: Nick Mah; Supplier 1: Digi-Key; Drawer_id: 1; Tolerance: 1%; Power: 1/10W; Package: 0805; ComponentLink1Description: Datasheet; Created_Date: 2018-10-20
R32 R33 R36 R37 = 505: Manufacturer_id: 1; idResistor: 505; Name: Res_1.0k_0805_1/10W_1%; Created_By: Nick Mah; Supplier 1: Digi-Key; Drawer_id: 1; Tolerance: 1%; Power: 1/10W; Package: 0805; ComponentLink1Description: Datasheet; Created_Date: 2018-10-20

## Sheet MAX680_10V_Converter.SchDoc
size A
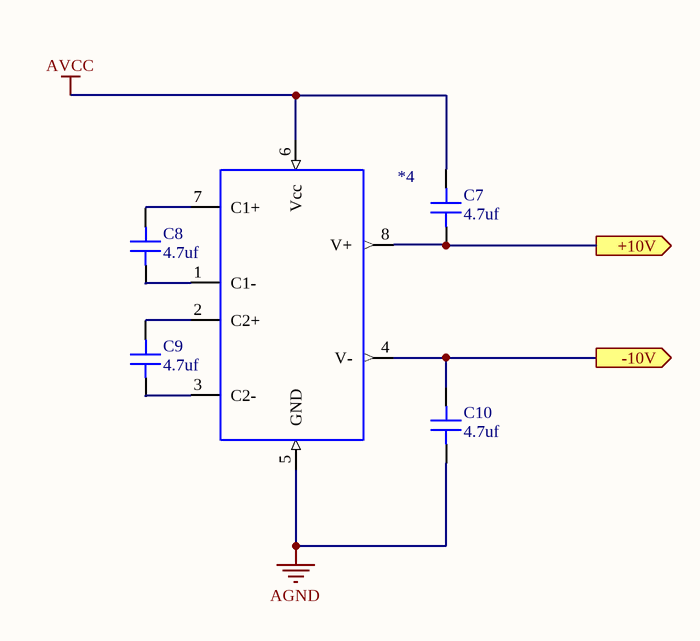
[diagram p7: MAX680_10V_Converter.SchDoc]

### Parts
(Parts that share a designator on the sheet are numbered #1, #2 ... from top to bottom, then left to right.)
*4  Null  [SOIC-8]  (value not drawn)
C7#2  value 4.7uf  [CAP 0805/2012]  (hidden comment: Capacitor MLCC 4.7uf 16V CAP 0805/2012)
C8#2  value 4.7uf  [CAP 0805/2012]  (hidden comment: Capacitor MLCC 4.7uf 16V CAP 0805/2012)
C9#2  value 4.7uf  [CAP 0805/2012]  (hidden comment: Capacitor MLCC 4.7uf 16V CAP 0805/2012)
C10#2  value 4.7uf  [CAP 0805/2012]  (hidden comment: Capacitor MLCC 4.7uf 16V CAP 0805/2012)

### Ports
+10V (out), -10V (out)

### Nets
AGND: *4.5(GND) C10#2.1
AVCC: *4.6(Vcc) C7#2.2
+10V: *4.8(V+) C7#2.1 ; port +10V
-10V: *4.4(V-) C10#2.2 ; port -10V
Net*4_1: *4.1(C1-) C8#2.1
Net*4_2: *4.2(C2+) C9#2.2
Net*4_3: *4.3(C2-) C9#2.1
Net*4_7: *4.7(C1+) C8#2.2

### Library data of the parts
*4 = 14: IC REG SWTCHD CAP INV 10MA 8SOIC; Manufacturer_id: 1; idPMIC_Lin: 14; Name: MAX680CSA; Value: 10V; Output_Config: Fixed; Num_Outputs: 2; Vin(Min): 2V; Vin(Max): 6V; Vout(Min): +2Vin; Created_By: Albert Panuco; Drawer_id: 1; Power: Null; Vout(Max): 10V; Vout_Type: Null; Current_Rating: 10mA; Dropout_Voltage: Null; Package: SOIC-8; MfrPartNo: MAX680CSA; Link: https://www.digikey.com/product-detail/en/maxim-integrated/MAX680CSA/MAX680CSA-ND/142563; ComponentLink1Description: Null; ComponentLink1URL: Null; Supplier1: Null; Supplier1PartNo: Null; Updated_By: Null
C7#2 C8#2 C9#2 C10#2 = 353: Manufacturer_id: 1; idCapacitor: 353; Name: Cap_4.7uf_16V_CAP 0805/2012; Dielectric: Ceramic; Created_By: Nick Mah; Drawer_id: 1; Voltage_Rating: 16V; Package: CAP 0805/2012; Created_Date: 10/20/2018

## Nets that join several sheets
AGND: TopLevel (N1.1), Connectors (8 pins), 5V Reference (8 pins), OVP_MCU_PINS (5 pins), U_Op-Amp Stage/U_Sallen-Key Filter (C29.1 C35.2 C42.1 C43.1), U_Op-Amp Stage/U_Sallen-Key Filter (C28.1 C33.2 C40.1 C41.1), U_Op-Amp Stage/U_Sallen-Key Filter (C30.1 C36.2 C44.1 C45.1), U_Op-Amp Stage/U_Sallen-Key Filter (C31.1 C37.2 C46.1 C47.1), U_Op-Amp Stage/U_Sallen-Key Filter (C27.1 C34.2 C38.1 C39.1), U_Op-Amp Stage/U_LBF Op-Amp Gain (C24_U_Op-Amp_Stage_U_LBF_Op-Amp_Gain#1.1 C25_U_Op-Amp_Stage_U_LBF_Op-Amp_Gain#1.1 R36_U_Op-Amp_Stage_U_LBF_Op-Amp_Gain#1.1 R37_U_Op-Amp_Stage_U_LBF_Op-Amp_Gain#1.1), U_Op-Amp Stage/U_LBF Op-Amp Gain (C24_U_Op-Amp_Stage_U_LBF_Op-Amp_Gain#2.1 C25_U_Op-Amp_Stage_U_LBF_Op-Amp_Gain#2.1 R36_U_Op-Amp_Stage_U_LBF_Op-Amp_Gain#2.1 R37_U_Op-Amp_Stage_U_LBF_Op-Amp_Gain#2.1), U_Op-Amp Stage/U_LBF Op-Amp Gain (C24_U_Op-Amp_Stage_U_LBF_Op-Amp_Gain#3.1 C25_U_Op-Amp_Stage_U_LBF_Op-Amp_Gain#3.1 R36_U_Op-Amp_Stage_U_LBF_Op-Amp_Gain#3.1 R37_U_Op-Amp_Stage_U_LBF_Op-Amp_Gain#3.1), U_Op-Amp Stage/U_LBF Op-Amp Gain (C24_U_Op-Amp_Stage_U_LBF_Op-Amp_Gain#4.1 C25_U_Op-Amp_Stage_U_LBF_Op-Amp_Gain#4.1 R36_U_Op-Amp_Stage_U_LBF_Op-Amp_Gain#4.1 R37_U_Op-Amp_Stage_U_LBF_Op-Amp_Gain#4.1), U_Op-Amp Stage/U_LBF Op-Amp Gain (C24_U_Op-Amp_Stage_U_LBF_Op-Amp_Gain#5.1 C25_U_Op-Amp_Stage_U_LBF_Op-Amp_Gain#5.1 R36_U_Op-Amp_Stage_U_LBF_Op-Amp_Gain#5.1 R37_U_Op-Amp_Stage_U_LBF_Op-Amp_Gain#5.1), MAX680_10V_Converter (*4.5 C10#2.1)
AVCC: 5V Reference (C4#1.2 R2#1.1 U2#1.2), U_Op-Amp Stage/U_LBF Op-Amp Gain (R32_U_Op-Amp_Stage_U_LBF_Op-Amp_Gain#1.2 R33_U_Op-Amp_Stage_U_LBF_Op-Amp_Gain#1.2), U_Op-Amp Stage/U_LBF Op-Amp Gain (R32_U_Op-Amp_Stage_U_LBF_Op-Amp_Gain#2.2 R33_U_Op-Amp_Stage_U_LBF_Op-Amp_Gain#2.2), U_Op-Amp Stage/U_LBF Op-Amp Gain (R32_U_Op-Amp_Stage_U_LBF_Op-Amp_Gain#3.2 R33_U_Op-Amp_Stage_U_LBF_Op-Amp_Gain#3.2), U_Op-Amp Stage/U_LBF Op-Amp Gain (R32_U_Op-Amp_Stage_U_LBF_Op-Amp_Gain#4.2 R33_U_Op-Amp_Stage_U_LBF_Op-Amp_Gain#4.2), U_Op-Amp Stage/U_LBF Op-Amp Gain (R32_U_Op-Amp_Stage_U_LBF_Op-Amp_Gain#5.2 R33_U_Op-Amp_Stage_U_LBF_Op-Amp_Gain#5.2), MAX680_10V_Converter (*4.6 C7#2.2)
DGND: TopLevel (N1.2), Connectors (X1.2), 5V Reference (*1.2 C1.1 C2.1 U1.1)
+10V: U_Op-Amp Stage/U_Sallen-Key Filter (C29.2 U4.6), U_Op-Amp Stage/U_Sallen-Key Filter (C28.2 U3#2.6), U_Op-Amp Stage/U_Sallen-Key Filter (C30.2 U5.6), U_Op-Amp Stage/U_Sallen-Key Filter (C31.2 U6.6), U_Op-Amp Stage/U_Sallen-Key Filter (C27.2 C34.1 U2#2.2 U2#2.6), U_Op-Amp Stage/U_LBF Op-Amp Gain (*3_U_Op-Amp_Stage_U_LBF_Op-Amp_Gain#1.6 C24_U_Op-Amp_Stage_U_LBF_Op-Amp_Gain#1.2), U_Op-Amp Stage/U_LBF Op-Amp Gain (*3_U_Op-Amp_Stage_U_LBF_Op-Amp_Gain#2.6 C24_U_Op-Amp_Stage_U_LBF_Op-Amp_Gain#2.2), U_Op-Amp Stage/U_LBF Op-Amp Gain (*3_U_Op-Amp_Stage_U_LBF_Op-Amp_Gain#3.6 C24_U_Op-Amp_Stage_U_LBF_Op-Amp_Gain#3.2), U_Op-Amp Stage/U_LBF Op-Amp Gain (*3_U_Op-Amp_Stage_U_LBF_Op-Amp_Gain#4.6 C24_U_Op-Amp_Stage_U_LBF_Op-Amp_Gain#4.2), U_Op-Amp Stage/U_LBF Op-Amp Gain (*3_U_Op-Amp_Stage_U_LBF_Op-Amp_Gain#5.6 C24_U_Op-Amp_Stage_U_LBF_Op-Amp_Gain#5.2), MAX680_10V_Converter (*4.8 C7#2.1)
-10V: U_Op-Amp Stage/U_Sallen-Key Filter (C35.1 U4.2), U_Op-Amp Stage/U_Sallen-Key Filter (C33.1 U3#2.2), U_Op-Amp Stage/U_Sallen-Key Filter (C36.1 U5.2), U_Op-Amp Stage/U_Sallen-Key Filter (C37.1 U6.2), U_Op-Amp Stage/U_LBF Op-Amp Gain (*3_U_Op-Amp_Stage_U_LBF_Op-Amp_Gain#1.2 C25_U_Op-Amp_Stage_U_LBF_Op-Amp_Gain#1.2), U_Op-Amp Stage/U_LBF Op-Amp Gain (*3_U_Op-Amp_Stage_U_LBF_Op-Amp_Gain#2.2 C25_U_Op-Amp_Stage_U_LBF_Op-Amp_Gain#2.2), U_Op-Amp Stage/U_LBF Op-Amp Gain (*3_U_Op-Amp_Stage_U_LBF_Op-Amp_Gain#3.2 C25_U_Op-Amp_Stage_U_LBF_Op-Amp_Gain#3.2), U_Op-Amp Stage/U_LBF Op-Amp Gain (*3_U_Op-Amp_Stage_U_LBF_Op-Amp_Gain#4.2 C25_U_Op-Amp_Stage_U_LBF_Op-Amp_Gain#4.2), U_Op-Amp Stage/U_LBF Op-Amp Gain (*3_U_Op-Amp_Stage_U_LBF_Op-Amp_Gain#5.2 C25_U_Op-Amp_Stage_U_LBF_Op-Amp_Gain#5.2), MAX680_10V_Converter (*4.4 C10#2.2)
IN 1: Connectors (X2.1), U_Op-Amp Stage/U_Sallen-Key Filter (R10#2.1)
IN 2: Connectors (X2.2), U_Op-Amp Stage/U_Sallen-Key Filter (R9#2.1)
IN 3: Connectors (X2.3), U_Op-Amp Stage/U_Sallen-Key Filter (R8#2.1)
IN 4: Connectors (X2.4), U_Op-Amp Stage/U_Sallen-Key Filter (R7#2.1)
IN 5: Connectors (X2.5), U_Op-Amp Stage/U_Sallen-Key Filter (R6#2.1)
IN 6: Connectors (X2.14), U_Op-Amp Stage/U_Sallen-Key Filter (R5.1)
IN 7: Connectors (X2.15), U_Op-Amp Stage/U_Sallen-Key Filter (R4.1)
IN 8: Connectors (X2.16), U_Op-Amp Stage/U_Sallen-Key Filter (R3#2.1)
IN 9: Connectors (X2.17), U_Op-Amp Stage/U_Sallen-Key Filter (R2#2.1)
IN 10: Connectors (X2.18), U_Op-Amp Stage/U_Sallen-Key Filter (R1#2.1)
Net*3_U_Op-Amp_Stage_U_LBF_Op-Amp_Gain#1_5: OVP_MCU_PINS (R7#1.2), U_Op-Amp Stage/U_LBF Op-Amp Gain (*3_U_Op-Amp_Stage_U_LBF_Op-Amp_Gain#1.5 R35_U_Op-Amp_Stage_U_LBF_Op-Amp_Gain#1.2)
Net*3_U_Op-Amp_Stage_U_LBF_Op-Amp_Gain#1_7: OVP_MCU_PINS (R6#1.2), U_Op-Amp Stage/U_LBF Op-Amp Gain (*3_U_Op-Amp_Stage_U_LBF_Op-Amp_Gain#1.7 R4_U_Op-Amp_Stage_U_LBF_Op-Amp_Gain#1.2)
Net*3_U_Op-Amp_Stage_U_LBF_Op-Amp_Gain#2_5: OVP_MCU_PINS (R9#1.2), U_Op-Amp Stage/U_LBF Op-Amp Gain (*3_U_Op-Amp_Stage_U_LBF_Op-Amp_Gain#2.5 R35_U_Op-Amp_Stage_U_LBF_Op-Amp_Gain#2.2)
Net*3_U_Op-Amp_Stage_U_LBF_Op-Amp_Gain#2_7: OVP_MCU_PINS (R8#1.2), U_Op-Amp Stage/U_LBF Op-Amp Gain (*3_U_Op-Amp_Stage_U_LBF_Op-Amp_Gain#2.7 R4_U_Op-Amp_Stage_U_LBF_Op-Amp_Gain#2.2)
Net*3_U_Op-Amp_Stage_U_LBF_Op-Amp_Gain#3_5: OVP_MCU_PINS (R11#1.2), U_Op-Amp Stage/U_LBF Op-Amp Gain (*3_U_Op-Amp_Stage_U_LBF_Op-Amp_Gain#3.5 R35_U_Op-Amp_Stage_U_LBF_Op-Amp_Gain#3.2)
Net*3_U_Op-Amp_Stage_U_LBF_Op-Amp_Gain#3_7: OVP_MCU_PINS (R10#1.2), U_Op-Amp Stage/U_LBF Op-Amp Gain (*3_U_Op-Amp_Stage_U_LBF_Op-Amp_Gain#3.7 R4_U_Op-Amp_Stage_U_LBF_Op-Amp_Gain#3.2)
Net*3_U_Op-Amp_Stage_U_LBF_Op-Amp_Gain#4_5: OVP_MCU_PINS (R13#1.2), U_Op-Amp Stage/U_LBF Op-Amp Gain (*3_U_Op-Amp_Stage_U_LBF_Op-Amp_Gain#4.5 R35_U_Op-Amp_Stage_U_LBF_Op-Amp_Gain#4.2)
Net*3_U_Op-Amp_Stage_U_LBF_Op-Amp_Gain#4_7: OVP_MCU_PINS (R12#1.2), U_Op-Amp Stage/U_LBF Op-Amp Gain (*3_U_Op-Amp_Stage_U_LBF_Op-Amp_Gain#4.7 R4_U_Op-Amp_Stage_U_LBF_Op-Amp_Gain#4.2)
Net*3_U_Op-Amp_Stage_U_LBF_Op-Amp_Gain#5_5: OVP_MCU_PINS (R15#1.2), U_Op-Amp Stage/U_LBF Op-Amp Gain (*3_U_Op-Amp_Stage_U_LBF_Op-Amp_Gain#5.5 R35_U_Op-Amp_Stage_U_LBF_Op-Amp_Gain#5.2)
Net*3_U_Op-Amp_Stage_U_LBF_Op-Amp_Gain#5_7: OVP_MCU_PINS (R14#1.2), U_Op-Amp Stage/U_LBF Op-Amp Gain (*3_U_Op-Amp_Stage_U_LBF_Op-Amp_Gain#5.7 R4_U_Op-Amp_Stage_U_LBF_Op-Amp_Gain#5.2)
NetC3#2_2: U_Op-Amp Stage/U_Sallen-Key Filter (C3#2.2 U2#2.3 U2#2.5), U_Op-Amp Stage/U_LBF Op-Amp Gain (R38_U_Op-Amp_Stage_U_LBF_Op-Amp_Gain#5.1)
NetC4#2_2: U_Op-Amp Stage/U_Sallen-Key Filter (C4#2.2 U2#2.7 U2#2.8), U_Op-Amp Stage/U_LBF Op-Amp Gain (R5_U_Op-Amp_Stage_U_LBF_Op-Amp_Gain#5.1)
NetC5#2_2: U_Op-Amp Stage/U_Sallen-Key Filter (C5#2.2 U3#2.3 U3#2.5), U_Op-Amp Stage/U_LBF Op-Amp Gain (R38_U_Op-Amp_Stage_U_LBF_Op-Amp_Gain#4.1)
NetC6#2_2: U_Op-Amp Stage/U_Sallen-Key Filter (C6#2.2 U3#2.7 U3#2.8), U_Op-Amp Stage/U_LBF Op-Amp Gain (R5_U_Op-Amp_Stage_U_LBF_Op-Amp_Gain#4.1)
NetC7#1_2: U_Op-Amp Stage/U_Sallen-Key Filter (C7#1.2 U4.3 U4.5), U_Op-Amp Stage/U_LBF Op-Amp Gain (R38_U_Op-Amp_Stage_U_LBF_Op-Amp_Gain#3.1)
NetC8#1_2: U_Op-Amp Stage/U_Sallen-Key Filter (C8#1.2 U4.7 U4.8), U_Op-Amp Stage/U_LBF Op-Amp Gain (R5_U_Op-Amp_Stage_U_LBF_Op-Amp_Gain#3.1)
NetC9#1_2: U_Op-Amp Stage/U_Sallen-Key Filter (C9#1.2 U5.3 U5.5), U_Op-Amp Stage/U_LBF Op-Amp Gain (R38_U_Op-Amp_Stage_U_LBF_Op-Amp_Gain#2.1)
NetC10#1_2: U_Op-Amp Stage/U_Sallen-Key Filter (C10#1.2 U5.7 U5.8), U_Op-Amp Stage/U_LBF Op-Amp Gain (R5_U_Op-Amp_Stage_U_LBF_Op-Amp_Gain#2.1)
NetC11_2: U_Op-Amp Stage/U_Sallen-Key Filter (C11.2 U6.3 U6.5), U_Op-Amp Stage/U_LBF Op-Amp Gain (R38_U_Op-Amp_Stage_U_LBF_Op-Amp_Gain#1.1)
NetC12_2: U_Op-Amp Stage/U_Sallen-Key Filter (C12.2 U6.7 U6.8), U_Op-Amp Stage/U_LBF Op-Amp Gain (R5_U_Op-Amp_Stage_U_LBF_Op-Amp_Gain#1.1)
SIGPWR: Connectors (8 pins), 5V Reference (C5#1.2 R3#1.1 U3#1.2)